# Altium schematic sheet 09-Peripherials.SchDoc
size A3; SheetNumber: 2; SheetTotal: 7
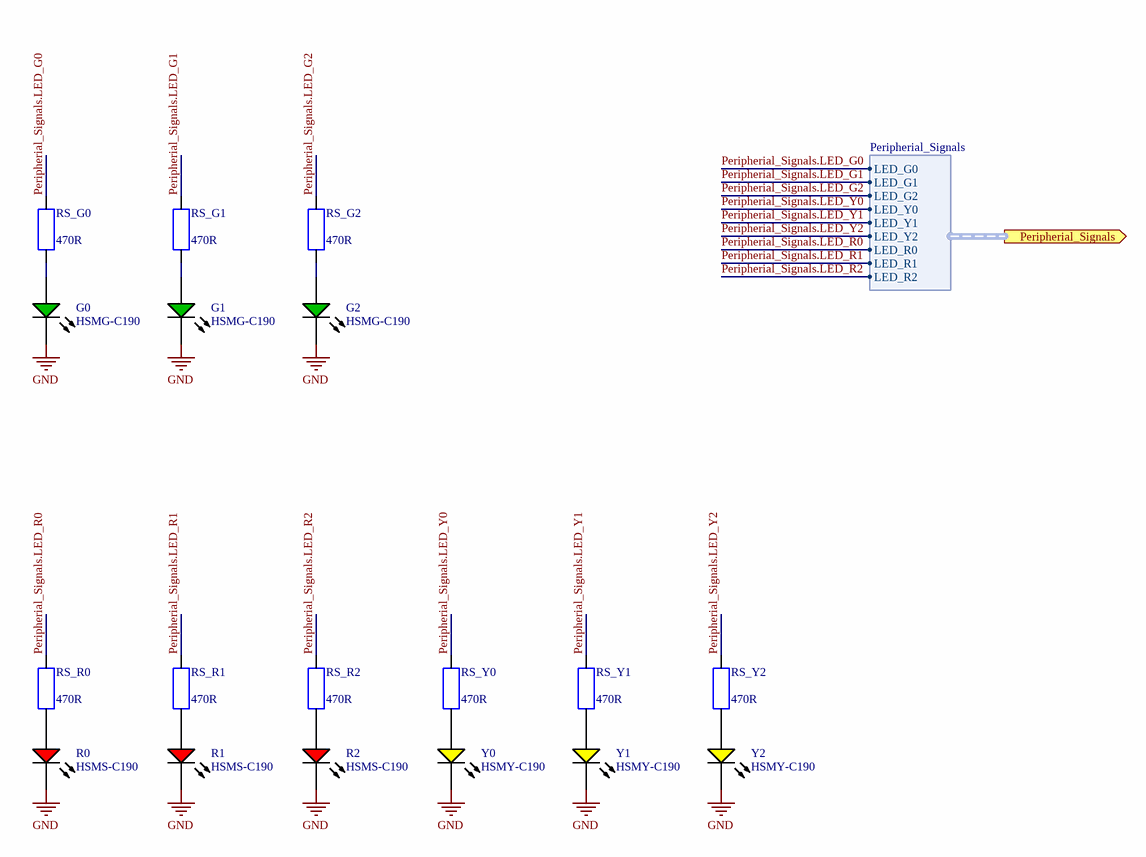
[diagram p0: 09-Peripherials.SchDoc]

## Parts
G0  HSMG-C190  [AVAG-HSMX-C190_V]
G1  HSMG-C190  [AVAG-HSMX-C190_V]
G2  HSMG-C190  [AVAG-HSMX-C190_V]
R0  HSMS-C190  [AVAG-HSMX-C190_V]
R1  HSMS-C190  [AVAG-HSMX-C190_V]
R2  HSMS-C190  [AVAG-HSMX-C190_V]
RS_G0  resistance: 470R  [0603_A]  (hidden comment: RS)
RS_G1  resistance: 470R  [0603_A]  (hidden comment: RS)
RS_G2  resistance: 470R  [0603_A]  (hidden comment: RS)
RS_R0  resistance: 470R  [0603_A]  (hidden comment: RS)
RS_R1  resistance: 470R  [0603_A]  (hidden comment: RS)
RS_R2  resistance: 470R  [0603_A]  (hidden comment: RS)
RS_Y0  resistance: 470R  [0603_A]  (hidden comment: RS)
RS_Y1  resistance: 470R  [0603_A]  (hidden comment: RS)
RS_Y2  resistance: 470R  [0603_A]  (hidden comment: RS)
Y0  HSMY-C190  [AVAG-HSMX-C190_V]
Y1  HSMY-C190  [AVAG-HSMX-C190_V]
Y2  HSMY-C190  [AVAG-HSMX-C190_V]

## Ports
Peripherial_Signals (out, harness Peripherial_Signals)

## Harnesses
Peripherial_Signals: LED_G0, LED_G1, LED_G2, LED_Y0, LED_Y1, LED_Y2, LED_R0, LED_R1, LED_R2

## Nets
GND: G0.2(K) G1.2(K) G2.2(K) R0.2(K) R1.2(K) R2.2(K) Y0.2(K) Y1.2(K) Y2.2(K)
Peripherial_Signals.LED_G0: RS_G0.2 ; port Peripherial_Signals.LED_G0
Peripherial_Signals.LED_G1: RS_G1.2 ; port Peripherial_Signals.LED_G1
Peripherial_Signals.LED_G2: RS_G2.2 ; port Peripherial_Signals.LED_G2
Peripherial_Signals.LED_R0: RS_R0.2 ; port Peripherial_Signals.LED_R0
Peripherial_Signals.LED_R1: RS_R1.2 ; port Peripherial_Signals.LED_R1
Peripherial_Signals.LED_R2: RS_R2.2 ; port Peripherial_Signals.LED_R2
Peripherial_Signals.LED_Y0: RS_Y0.2 ; port Peripherial_Signals.LED_Y0
Peripherial_Signals.LED_Y1: RS_Y1.2 ; port Peripherial_Signals.LED_Y1
Peripherial_Signals.LED_Y2: RS_Y2.2 ; port Peripherial_Signals.LED_Y2
NetG0_1: G0.1(A) RS_G0.1
NetG1_1: G1.1(A) RS_G1.1
NetG2_1: G2.1(A) RS_G2.1
NetR0_1: R0.1(A) RS_R0.1
NetR1_1: R1.1(A) RS_R1.1
NetR2_1: R2.1(A) RS_R2.1
NetRS_Y0_1: RS_Y0.1 Y0.1(A)
NetRS_Y1_1: RS_Y1.1 Y1.1(A)
NetRS_Y2_1: RS_Y2.1 Y2.1(A)

## Notes on the sheet
- Title:
- Date:
- SVN:
- Ver:
- Sheet Size:
- A3
- Sheet Name:
- OF
- Checked By:
- Drawn By:
- Damian Szczypior
- Rev:
- Alle Rechte vorbehalten. Kopien ohne Erlaubnis der X2E GmbH sind nicht gestattet. Dieses Dokument darf ohne die Erlaubnis der X2E GmbH nicht an Dritte (auch nicht in Auszügen) weitergegeben werden .
- Sheet:

## Library data of the parts
G0-G2 = CMP-1744-00002-1: Chip LED, Green, 2.2 V, -40 to 85 degC, 2-Pin SMD, RoHS, Tape and Reel; Frequency: 400 KHz; Max Supply Voltage: 5.5 V; Access Time: 3500 ns; Clock Frequency: 100 KHz; Case\Package: SOIC; Density: 32 kb; Nominal Supply Current: 2 mA; Interface: Serial; Min Supply Voltage: 1.7 V; Packaging: Tape and Reel; PackageReference: HSMX-C190; ComponentLink2URL: http://docs.avagotech.com/docs/AV02-0551EN; RoHSCompliant: true; Pins: 8; REACH SVHC: No SVHC; Max Operating Temperature: 85 degC; Width: 4 mm; Radiation Hardening: No; Package Quantity: 3000; ComponentLink3Description: Package Specification; ComponentLink1Description: Manufacturer URL; Min Operating Temperature: -40 degC; PackageDescription: 2-Pin Surface Mount Device, Body 1.6 x 0.8 mm, Height 0.9 mm; Max Clock Frequency: 100 KHz; Height: 1.5 mm; ComponentLink1URL: http://www.avagotech.com/; DatasheetVersion: Mar-12; ComponentLink2Description: Datasheet; Mount: Surface Mount; Length: 5 mm; ComponentLink3URL: http://www.fairchildsemi.com/dwg/MA/MA03D.pdf
R0-R2 = CMP-2000-06427-1: LED Uni-Color Red, 52 mW, 20 mA, -40 to 85 degC, 2-Pin SMD, RoHS, Tape and Reel; Manufacturer: Avago; Reverse Voltage: 5V; Viewing Angle: 170deg; High Brightness: No; Lens Type: ColorlessDiffused; DELETED: Compliant; Product Height (mm): 0.8mm; Dominant Wave Length: 626nm; Number of  Elements: 1; Chip Material: GaP; Lum Intensity: 10mcd; Product Length (mm): 1.6mm; Forward Voltage: 2.6V; Power Dissipation: 52W; Shape Type: Rectangular; Forward Current: 25mA; Peak Wavelength: 630nm; Test Current (It): 20mA; Main Category: ChipLED; Lens Dimensions: 1x0.8x0.5mm; Pin Count: 2; Package Reference: HSMX-C190; Mounting Technology: SurfaceMount; Mounting: SurfaceMount; Datasheet URL: http://docs.avagotech.com/docs/AV02-0551EN; Package Type: ChipLed; Operating Temperature Classification: Industrial; Datasheet Version: 03/2012; Operating Temp Range: -40Cto85C; Emitting Color: Red; Rad Hardened: No; Manufacturer URL: http://www.avagotech.com/; Luminous Intensity: 10mcd; Package Description: 2-Pin Surface Mount Device, Body 1.6 x 0.8 mm, Height 0.9 mm; Type: Uni-Color; Packaging: TapeandReel; Product Depth (mm): 0.8mm
RS_G0-RS_G2 RS_R0-RS_R2 RS_Y0-RS_Y2 = X_00000061: manufacturer: Yageo; entity_name: RS_0603_470R_W100_1P00_100PPM; entity_type_name: resistor_standard; power: W100; temp_coefficient: 100PPM; tolerance: 1P00; release: blocked; max_operating_temp: 125C; min_operating_temp: -55C; ordering_information_btm: 311-470HRDKR-ND; used_in_bom: 1; production_status: Aktiv; x2e_number: X_00000061; series: RC0603; height: mm450; width: mm800; length: 1mm60; package: 0603
Y0-Y2 = CMP-1744-00003-1: LED Uni-Color Yellow, 65 mW, 20 mA, -40 to 85 degC, 2-Pin SMD, RoHS, Tape and Reel; Tolerance: 1%; Voltage Rating: 50 V; Power Rating: 100 mW; Case\Package: 0603; Resistance: 390 Ohm; Min Operating Temperature: -55 degC; Length: 1.6 mm; ComponentLink3Description: Package Specification; Mount: Surface Mount; PackageReference: HSMX-C190; ComponentLink2Description: Datasheet; DatasheetVersion: Mar-12; Case Code (Metric): 1608; Pins: 2; Package Quantity: 5000; ComponentLink2URL: http://docs.avagotech.com/docs/AV02-0551EN; ComponentLink1Description: Manufacturer URL; RoHSCompliant: true; Packaging: Tape and Reel; PackageDescription: 2-Pin Surface Mount Device, Body 1.6 x 0.8 mm, Height 0.9 mm; REACH SVHC: No SVHC; ComponentLink3URL: http://www.fairchildsemi.com/dwg/MA/MA03D.pdf; Voltage Rating (DC): 50 V; Width: 0.8 mm; ComponentLink1URL: http://www.avagotech.com/; Max Operating Temperature: 155 degC; Case Code (Imperial): 0603; Height: 0.45 mm